# Altium project DigitalInputBoard.PrjPcb
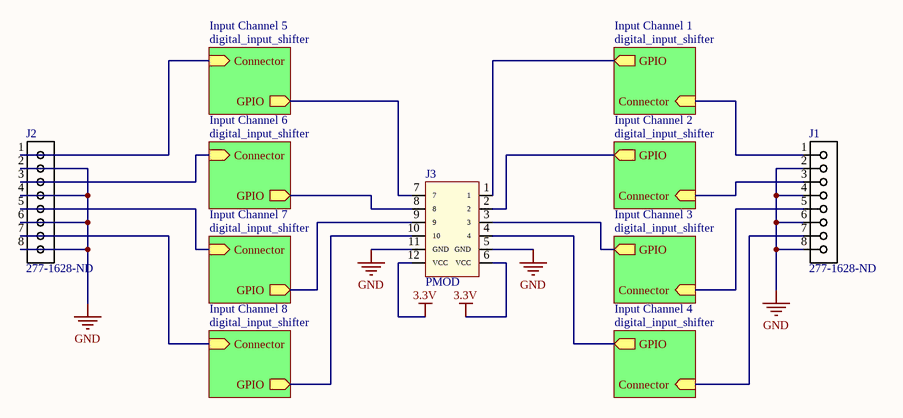
[diagram p0: Main.SchDoc]
2 sheets, 19 parts. Net scope: hierarchical (ports join the sheet entries above them; power ports are global).
Board file: Main.PcbDoc
Sheets:
  Main.SchDoc
    Input Channel 2 = digital_input_shifter.SchDoc
    Input Channel 3 = digital_input_shifter.SchDoc
    Input Channel 4 = digital_input_shifter.SchDoc
    Input Channel 5 = digital_input_shifter.SchDoc
    Input Channel 6 = digital_input_shifter.SchDoc
    Input Channel 7 = digital_input_shifter.SchDoc
    Input Channel 8 = digital_input_shifter.SchDoc
    Input Channel 1 = digital_input_shifter.SchDoc

## Sheet Main.SchDoc: Digital Input Breakout Board
size Letter; Revision: 1.0; SheetNumber: 1; SheetTotal: 2; Client: Facebook; LeaflabsProject: Sawyer

### Parts
J1  Supplier Part Number 1: 277-1628-ND  [PHOENIX_8]  (hidden comment: Phoenix Teminal Block)
J2  Supplier Part Number 1: 277-1628-ND  [PHOENIX_8]  (hidden comment: Phoenix Teminal Block)
J3  PMOD  [PMOD_6x2_male]

### Sub-sheets
Input Channel 1 = digital_input_shifter: Connector (in), GPIO (out)
Input Channel 2 = digital_input_shifter: GPIO (out), Connector (in)
Input Channel 3 = digital_input_shifter: GPIO (out), Connector (in)
Input Channel 4 = digital_input_shifter: GPIO (out), Connector (in)
Input Channel 5 = digital_input_shifter: GPIO (out), Connector (in)
Input Channel 6 = digital_input_shifter: GPIO (out), Connector (in)
Input Channel 7 = digital_input_shifter: Connector (in), GPIO (out)
Input Channel 8 = digital_input_shifter: Connector (in), GPIO (out)

### Nets
3.3V: J3.6(VCC) J3.12(VCC)
GND: J1.2 J1.4 J1.6 J1.8 J2.2 J2.4 J2.6 J2.8 J3.5(GND) J3.11(GND)
NetD1_Input_Channel_1_3: J3.1 ; sheet Input Channel 1/GPIO
NetD1_Input_Channel_2_3: J3.2 ; sheet Input Channel 2/GPIO
NetD1_Input_Channel_3_3: J3.3 ; sheet Input Channel 3/GPIO
NetD1_Input_Channel_4_3: J3.4 ; sheet Input Channel 4/GPIO
NetD1_Input_Channel_5_3: J3.7 ; sheet Input Channel 5/GPIO
NetD1_Input_Channel_6_3: J3.8 ; sheet Input Channel 6/GPIO
NetD1_Input_Channel_7_3: J3.9 ; sheet Input Channel 7/GPIO
NetD1_Input_Channel_8_3: J3.10 ; sheet Input Channel 8/GPIO
NetJ1_1: J1.1 ; sheet Input Channel 1/Connector
NetJ1_3: J1.3 ; sheet Input Channel 2/Connector
NetJ1_5: J1.5 ; sheet Input Channel 3/Connector
NetJ1_7: J1.7 ; sheet Input Channel 4/Connector
NetJ2_1: J2.1 ; sheet Input Channel 5/Connector
NetJ2_3: J2.3 ; sheet Input Channel 6/Connector
NetJ2_5: J2.5 ; sheet Input Channel 7/Connector
NetJ2_7: J2.7 ; sheet Input Channel 8/Connector

### Notes on the sheet
- PROJ
- TITLE
- CLIENT
- REV
- DATE
- LeafLabs
- SHEET
- OF
- CONFIDENTIAL. DO NOT DISTRIBUTE.

### Library data of the parts
J3 = PMOD Male 2-row: 2x6 PMOD right angle board connector.
J1 J2 = Phoenix Teminal Block: Supplier 1: Digi-Key

## Sheet digital_input_shifter.SchDoc: Digital Input Breakout Board - Level Clipper
size Letter; Revision: 1.0; SheetNumber: 2; SheetTotal: 2; Client: Facebook; LeaflabsProject: Sawyer
Used 8 times, as channels Input Channel 2, Input Channel 3, Input Channel 4, Input Channel 5, Input Channel 6, Input Channel 7, Input Channel 8, Input Channel 1. Parts and nets are listed once, with the designators drawn on the sheet.
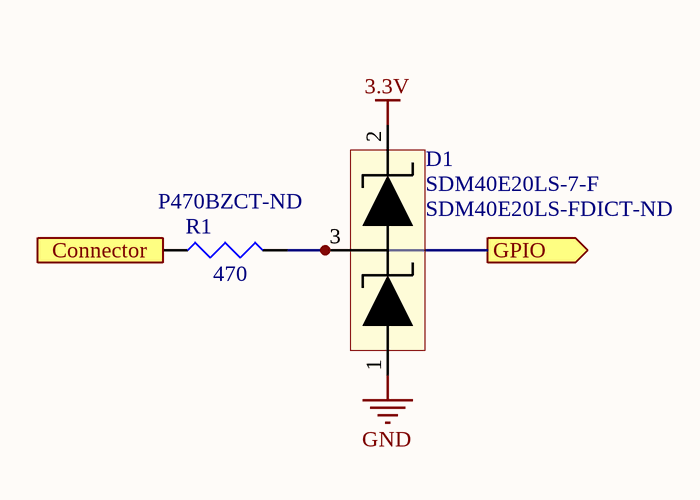
[diagram p1: digital_input_shifter.SchDoc]

### Parts
D1  SDM40E20LS-7-F  Supplier Part Number 1: SDM40E20LS-FDICT-ND  [SOT-23_N]
R1  value 470  Supplier Part Number 1: P470BZCT-ND  [J1-0603]  (hidden comment: Res3)

### Ports
Connector (in), GPIO (out)

### Nets
3.3V: D1.2
GND: D1.1
Connector: R1.1 ; port Connector
GPIO: D1.3 R1.2 ; port GPIO

### Channels
Input Channel 2: designators end in _Input_Channel_2; ports Connector=NetJ1_3 GPIO=NetD1_Input_Channel_2_3
Input Channel 3: designators end in _Input_Channel_3; ports Connector=NetJ1_5 GPIO=NetD1_Input_Channel_3_3
Input Channel 4: designators end in _Input_Channel_4; ports Connector=NetJ1_7 GPIO=NetD1_Input_Channel_4_3
Input Channel 5: designators end in _Input_Channel_5; ports Connector=NetJ2_1 GPIO=NetD1_Input_Channel_5_3
Input Channel 6: designators end in _Input_Channel_6; ports Connector=NetJ2_3 GPIO=NetD1_Input_Channel_6_3
Input Channel 7: designators end in _Input_Channel_7; ports Connector=NetJ2_5 GPIO=NetD1_Input_Channel_7_3
Input Channel 8: designators end in _Input_Channel_8; ports Connector=NetJ2_7 GPIO=NetD1_Input_Channel_8_3
Input Channel 1: designators end in _Input_Channel_1; ports Connector=NetJ1_1 GPIO=NetD1_Input_Channel_1_3

### Notes on the sheet
- PROJ
- TITLE
- CLIENT
- REV
- DATE
- LeafLabs
- SHEET
- OF
- CONFIDENTIAL. DO NOT DISTRIBUTE.

### Library data of the parts
D1 = SDM40E20LS-7-F: SDM40E20LS-7-F schottky series pair diode.; Supplier 1: Digi-Key
R1 = Res3: Resistor; Published: 8-Jun-2000; LatestRevisionDate: 29-May-2009; LatestRevisionNote: IPC-7351 Footprint Added.; PackageReference: J1-0603; Publisher: Altium Limited; PackageDescription: Chip Resistor; Supplier 1: Digi-Key

## Nets that join several sheets
3.3V: Main (J3.6 J3.12), Input Channel 2 (D1_Input_Channel_2.2), Input Channel 3 (D1_Input_Channel_3.2), Input Channel 4 (D1_Input_Channel_4.2), Input Channel 5 (D1_Input_Channel_5.2), Input Channel 6 (D1_Input_Channel_6.2), Input Channel 7 (D1_Input_Channel_7.2), Input Channel 8 (D1_Input_Channel_8.2), Input Channel 1 (D1_Input_Channel_1.2)
GND: Main (10 pins), Input Channel 2 (D1_Input_Channel_2.1), Input Channel 3 (D1_Input_Channel_3.1), Input Channel 4 (D1_Input_Channel_4.1), Input Channel 5 (D1_Input_Channel_5.1), Input Channel 6 (D1_Input_Channel_6.1), Input Channel 7 (D1_Input_Channel_7.1), Input Channel 8 (D1_Input_Channel_8.1), Input Channel 1 (D1_Input_Channel_1.1)
NetD1_Input_Channel_1_3: Main (J3.1), Input Channel 1 (D1_Input_Channel_1.3 R1_Input_Channel_1.2)
NetD1_Input_Channel_2_3: Main (J3.2), Input Channel 2 (D1_Input_Channel_2.3 R1_Input_Channel_2.2)
NetD1_Input_Channel_3_3: Main (J3.3), Input Channel 3 (D1_Input_Channel_3.3 R1_Input_Channel_3.2)
NetD1_Input_Channel_4_3: Main (J3.4), Input Channel 4 (D1_Input_Channel_4.3 R1_Input_Channel_4.2)
NetD1_Input_Channel_5_3: Main (J3.7), Input Channel 5 (D1_Input_Channel_5.3 R1_Input_Channel_5.2)
NetD1_Input_Channel_6_3: Main (J3.8), Input Channel 6 (D1_Input_Channel_6.3 R1_Input_Channel_6.2)
NetD1_Input_Channel_7_3: Main (J3.9), Input Channel 7 (D1_Input_Channel_7.3 R1_Input_Channel_7.2)
NetD1_Input_Channel_8_3: Main (J3.10), Input Channel 8 (D1_Input_Channel_8.3 R1_Input_Channel_8.2)
NetJ1_1: Main (J1.1), Input Channel 1 (R1_Input_Channel_1.1)
NetJ1_3: Main (J1.3), Input Channel 2 (R1_Input_Channel_2.1)
NetJ1_5: Main (J1.5), Input Channel 3 (R1_Input_Channel_3.1)
NetJ1_7: Main (J1.7), Input Channel 4 (R1_Input_Channel_4.1)
NetJ2_1: Main (J2.1), Input Channel 5 (R1_Input_Channel_5.1)
NetJ2_3: Main (J2.3), Input Channel 6 (R1_Input_Channel_6.1)
NetJ2_5: Main (J2.5), Input Channel 7 (R1_Input_Channel_7.1)
NetJ2_7: Main (J2.7), Input Channel 8 (R1_Input_Channel_8.1)